# Altium schematic sheet PIC32ETH_Power.SchDoc: Power
size A4; SheetNumber: 6
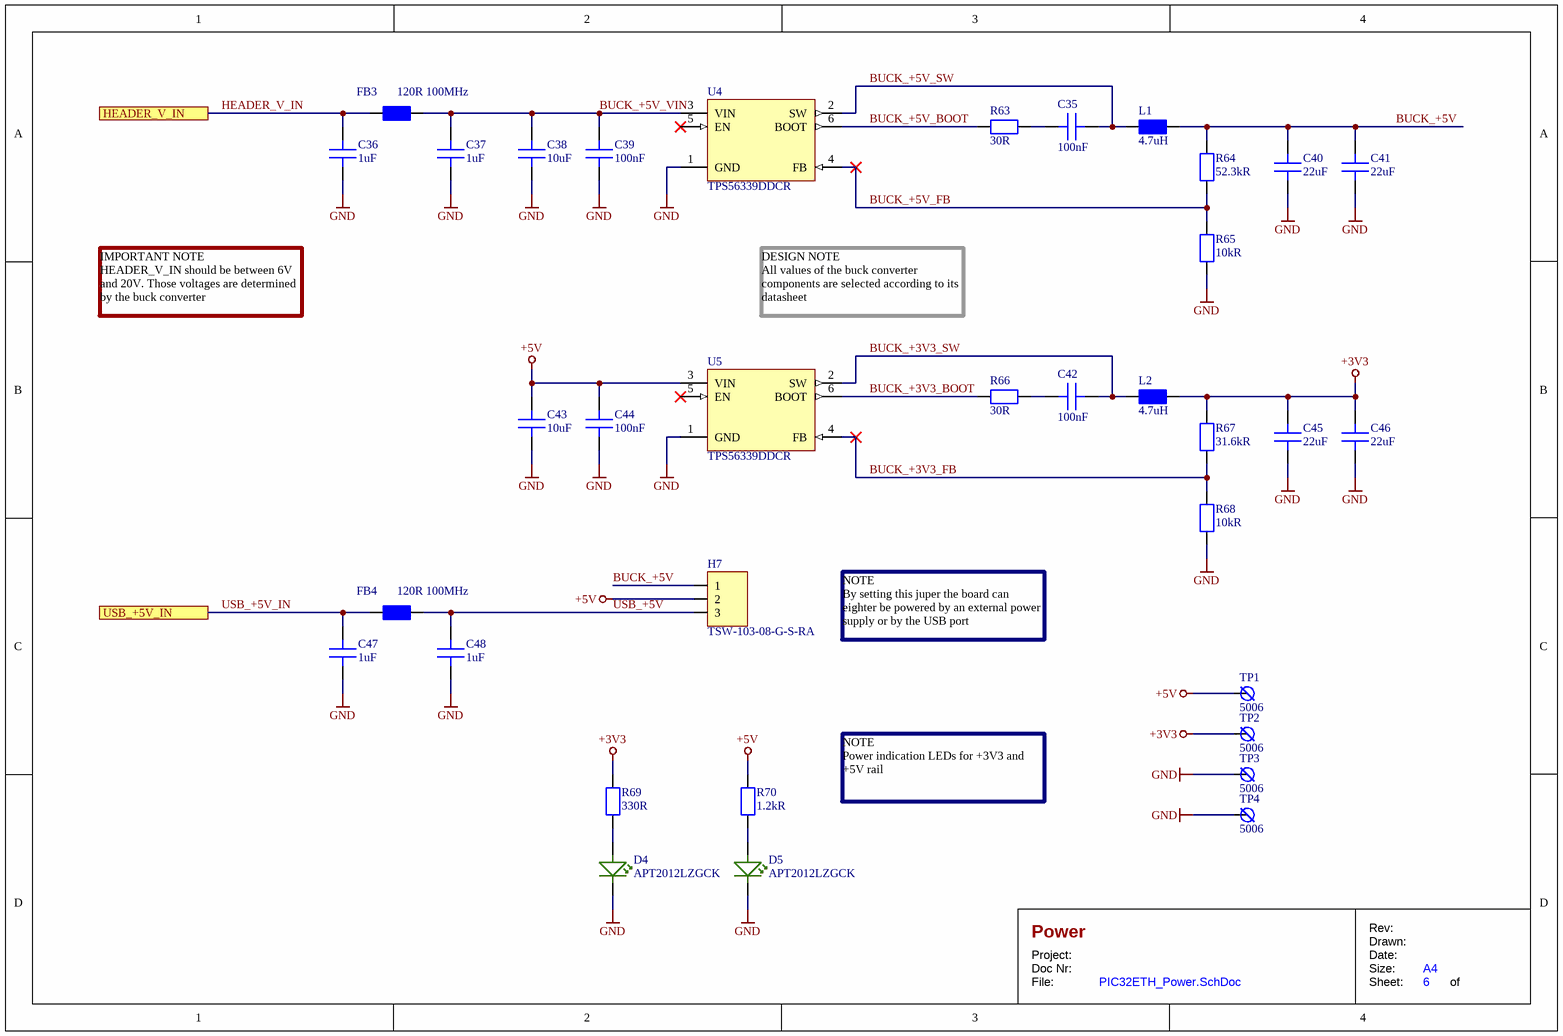
[diagram p0: PIC32ETH_Power.SchDoc]

## Parts
C35  100nF  [C_CHIP2012N]
C36  1uF  [C_CHIP2012N]
C37  1uF  [C_CHIP2012N]
C38  10uF  [C_CHIP3216N]
C39  100nF  [C_CHIP2012N]
C40  22uF  [C_CHIP3216N]
C41  22uF  [C_CHIP3216N]
C42  100nF  [C_CHIP2012N]
C43  10uF  [C_CHIP3216N]
C44  100nF  [C_CHIP2012N]
C45  22uF  [C_CHIP3216N]
C46  22uF  [C_CHIP3216N]
C47  1uF  [C_CHIP2012N]
C48  1uF  [C_CHIP2012N]
D4  APT2012LZGCK  [D_LEDCHIP2012N]
D5  APT2012LZGCK  [D_LEDCHIP2012N]
FB3  120R 100MHz  [FB_CHIP3216N]
FB4  120R 100MHz  [FB_CHIP3216N]
H7  TSW-103-08-G-S-RA  [H_TSW-103-08-G-S-RA]
L1  4.7uH  [L_CHIP2520N]
L2  4.7uH  [L_CHIP2520N]
R63  30R  [R_CHIP2012N]
R64  52.3kR  [R_CHIP2012N]
R65  10kR  [R_CHIP2012N]
R66  30R  [R_CHIP2012N]
R67  31.6kR  [R_CHIP2012N]
R68  10kR  [R_CHIP2012N]
R69  330R  [R_CHIP2012N]
R70  1.2kR  [R_CHIP2012N]
TP1  5006  [TP_5006]
TP2  5006  [TP_5006]
TP3  5006  [TP_5006]
TP4  5006  [TP_5006]
U4  TPS56339DDCR  [U_SOT95P280X145-6N]
U5  TPS56339DDCR  [U_SOT95P280X145-6N]

## Ports
HEADER_V_IN, USB_+5V_IN

## Nets
+3V3: C45.2 C46.2 L2.2 R67.2 R69.2 TP2.1(A)
+5V: C43.2 C44.2 H7.2 R70.2 TP1.1(A) U5.3(VIN)
GND: C36.1 C37.1 C38.1 C39.1 C40.1 C41.1 C43.1 C44.1 C45.1 C46.1 C47.1 C48.1 D4.1 D5.1 R65.1 R68.1 TP3.1(A) TP4.1(A) U4.1(GND) U5.1(GND)
BUCK_+3V3_BOOT: R66.1 U5.6(BOOT)
BUCK_+3V3_FB: R67.1 R68.2 U5.4(FB)
BUCK_+3V3_SW: C42.1 L2.1 U5.2(SW)
BUCK_+5V: C40.2 C41.2 H7.1 L1.2 R64.2
BUCK_+5V_BOOT: R63.1 U4.6(BOOT)
BUCK_+5V_FB: R64.1 R65.2 U4.4(FB)
BUCK_+5V_SW: C35.1 L1.1 U4.2(SW)
BUCK_+5V_VIN: C37.2 C38.2 C39.2 FB3.2 U4.3(VIN)
HEADER_V_IN: C36.2 FB3.1 ; port HEADER_V_IN
USB_+5V: C48.2 FB4.2 H7.3
USB_+5V_IN: C47.2 FB4.1 ; port USB_+5V_IN
NetC35_2: C35.2 R63.2
NetC42_2: C42.2 R66.2
NetD4_2: D4.2 R69.1
NetD5_2: D5.2 R70.1

Not connected (* = marked no-connect by the designer): U4 5(EN)*; U5 5(EN)*

## Notes on the sheet
- IMPORTANT NOTE
  HEADER_V_IN should be between 6V and 20V. Those voltages are determined by the buck converter
- DESIGN NOTE
  All values of the buck converter components are selected according to its datasheet
- NOTE
  By setting this juper the board can eighter be powered by an external power supply or by the USB port
- NOTE
  Power indication LEDs for +3V3 and +5V rail
- Project:
- Doc Nr:
- File:
- Drawn:
- Rev:
- Date:
- Size:
- Sheet:
- A4
- of

## Library data of the parts
C35 C39 C42 C44 = C_C0805C104K5RACTU: C CERAMIC 100nF 50V 10% 2012; Manufacturer: Kemet; Dielectric: X7R; Tolerance: +/-10%; Datasheet Url: https://content.kemet.com/datasheets/KEM_C1002_X7R_SMD.pdf; Mounting: SMT; Package: 2012; Part Number: C0805C104K5RACTU; Price: 0.23; Price Currency: CHF; Supplier 1: Digi-Key; Capacitance: 100nF; Voltage: 50V; Supplier Part Number 1: 399-1170-1-ND; Esr: n/a; Pin Count: 2; Temperature Range: -55degC to 125degC
C36 C37 C47 C48 = C_C0805C105K5RACTU: C CERAMIC 1uF 50V 10% 2012; Manufacturer: Kemet; Dielectric: X7R; Tolerance: +/-10%; Datasheet Url: https://content.kemet.com/datasheets/KEM_C1002_X7R_SMD.pdf; Mounting: SMT; Package: 2012; Part Number: C0805C105K5RACTU; Price: 0.32; Price Currency: CHF; Supplier 1: Digi-Key; Capacitance: 1uF; Voltage: 50V; Supplier Part Number 1: 399-7409-1-ND; Esr: n/a; Pin Count: 2; Temperature Range: -55degC to 125degC
C38 C43 = C_C1206C106K3RACTU: C CERAMIC 10uF 25V 10% 3216; Manufacturer: Kemet; Dielectric: X7R; Tolerance: +/-10%; Package: 3216; Supplier 1: Digi-Key; Part Number: C1206C106K3RACTU; Temperature Range: -55degC to 125degC; Datasheet Url: https://content.kemet.com/datasheets/KEM_C1002_X7R_SMD.pdf; Mounting: SMT; Price: 0.62; Price Currency: CHF; Note: *; Capacitance: 10uF; Voltage: 25V; Pin Count: 2; Esr: n/a; Supplier Part Number 1: 399-7442-1-ND
C40 C41 C45 C46 = C_C1206C226K8RAC7800: C CERAMIC 22uF 10V 10% 3216; Manufacturer: Kemet; Dielectric: X7R; Tolerance: +/-10%; Package: 3216; Supplier 1: Digi-Key; Part Number: C1206C226K8RAC7800; Temperature Range: -55degC to 125degC; Datasheet Url: https://api.kemet.com/component-edge/download/datasheet/C1206C226K8RAC7800.pdf; Mounting: SMT; Price: 0.65; Price Currency: CHF; Note: *; Capacitance: 22uF; Voltage: 10V; Pin Count: 2; Esr: n/a; Supplier Part Number 1: 399-11947-1-ND
D4 D5 = D_APT2012LZGCK: D LED GREEN CLEAR 2.65V 2mA 2012; Manufacturer: Kingbright; Voltage Reverse: 5V; Current Reverse: 50uA; Power: 102.5mW; Datasheet URL: http://www.kingbrightusa.com/images/catalog/SPEC/APT2012LZGCK.pdf; Mounting: SMT; Package: 2012; Part Number: APT2012LZGCK; Price: 0.55; Price Currency: CHF; Supplier 1: Digi-Key; Supplier Part Number 1: 754-1939-1-ND; Temperature Range: -40degC to 85degC; Pin Count: 2; Current Forward: 2mA; Voltage Forward: 2.65V; Color: Green; Lens Transparency: Clear
FB3 FB4 = FB_BLM31KN121SN1L: FB 120R 100MHz 6A 3216; Manufacturer: Murata Electronics; Resistance: 9mR; Datasheet Url: https://www.murata.com/en-us/products/productdata/8801529331742/ENFA0091.pdf; Mounting: SMT; Package: 3216; Part Number: BLM31KN121SN1L; Price: 0.29; Price Currency: CHF; Supplier 1: Digi-Key; Supplier Part Number 1: 490-16524-1-ND; Temperature Range: -55degC to 125degC; Pin Count: 2; Current: 6A; Impedance: 120R 100MHz
H7 = H_TSW-103-08-G-S-RA: H GENERAL HEADER 3POS 1ROW 2.54mm ANGLE THT; Manufacturer: Samtec Inc.; Current: 5.7A; Voltage: 550VAC, 770VDC; Positions: 3; Rows: 1; Datasheet URL: http://suddendocs.samtec.com/catalog_english/tsw_th.pdf; Mounting: THT; Package: n/a; Part Number: TSW-103-08-G-S-RA; Price: 0.40; Price Currency: CHF; Supplier 1: Digi-Key; Supplier Part Number 1: SAM1039-03-ND; Temperature Range: -55degC to 125degC; Pin Count: 3; Mating Cycles: n/a; Header Type: Header; Orientation: Angle; Spacing: 2.54mm
L1 L2 = L_LQM2HPN4R7MG0L: L CERAMIC 4.7uH 1.1A 138mR 2520; Manufacturer: Murata Electronics; Tolerance: +/-20%; Datasheet Url: https://search.murata.co.jp/Ceramy/image/img/P02/JELF243B-0019.pdf; Mounting: SMT; Package: 2520; Part Number: LQM2HPN4R7MG0L; Price: 0.28; Price Currency: CHF; Supplier 1: Digi-Key; Inductance: 4.7uH; Voltage: n/a; Supplier Part Number 1: 490-5116-1-ND; Pin Count: 2; Temperature Range: -55degC to 125degC; Current: 1.1A; Resistance: 138mR
R63 R66 = R_RMCF0805FT30R0: R SMT 30R 1% 125mW 2012; Manufacturer: Stackpole Electronics Inc; Temperature Coefficient: 100ppm/degC; Tolerance: +/-1%; Voltage: 150V; Datasheet Url: https://www.seielect.com/catalog/sei-rmcf_rmcp.pdf; Mounting: SMT; Package: 2012; Part Number: RMCF0805FT30R0; Price: 0.10; Price Currency: CHF; Supplier 1: Digi-Key; Resistance: 30R; Supplier Part Number 1: RMCF0805FT30R0CT-ND; Temperature Range: -55degC to 155degC; Pin Count: 2; Power: 125mW
R64 = R_RMCF0805FT52K3: R SMT 52.3kR 1% 125mW 2012; Manufacturer: Stackpole Electronics Inc; Temperature Coefficient: 100ppm/degC; Tolerance: +/-1%; Voltage: 150V; Datasheet Url: https://www.seielect.com/catalog/sei-rmcf_rmcp.pdf; Mounting: SMT; Package: 2012; Part Number: RMCF0805FT52K3; Price: 0.10; Price Currency: CHF; Supplier 1: Digi-Key; Resistance: 52.3kR; Supplier Part Number 1: RMCF0805FT52K3CT-ND; Temperature Range: -55degC to 155degC; Pin Count: 2; Power: 125mW
R65 R68 = R_RMCF0805FT10K0: R SMT 10kR 1% 125mW 2012; Manufacturer: Stackpole Electronics Inc; Temperature Coefficient: 100ppm/degC; Tolerance: +/-1%; Voltage: 150V; Datasheet Url: https://www.seielect.com/catalog/sei-rmcf_rmcp.pdf; Mounting: SMT; Package: 2012; Part Number: RMCF0805FT10K0; Price: 0.10; Price Currency: CHF; Supplier 1: Digi-Key; Resistance: 10kR; Power: 125mW; Supplier Part Number 1: RMCF0805FT10K0CT-ND; Pin Count: 2; Temperature Range: -55degC to 155degC
R67 = R_RMCF0805FT31K6: R SMT 31.6kR 1% 125mW 2012; Manufacturer: Stackpole Electronics Inc; Temperature Coefficient: 100ppm/degC; Tolerance: +/-1%; Voltage: 150V; Datasheet Url: https://www.seielect.com/catalog/sei-rmcf_rmcp.pdf; Mounting: SMT; Package: 2012; Part Number: RMCF0805FT31K6; Price: 0.10; Price Currency: CHF; Supplier 1: Digi-Key; Resistance: 31.6kR; Supplier Part Number 1: RMCF0805FT31K6CT-ND; Temperature Range: -55degC to 155degC; Pin Count: 2; Power: 125mW
R69 = R_RMCF0805FT330R: R SMT 330R 1% 125mW 2012; Manufacturer: Stackpole Electronics Inc; Temperature Coefficient: 100ppm/degC; Tolerance: +/-1%; Voltage: 150V; Datasheet Url: https://www.seielect.com/catalog/sei-rmcf_rmcp.pdf; Mounting: SMT; Package: 2012; Part Number: RMCF0805FT330R; Price: 0.10; Price Currency: CHF; Supplier 1: Digi-Key; Resistance: 330R; Supplier Part Number 1: RMCF0805FT330RCT-ND; Temperature Range: -55degC to 155degC; Pin Count: 2; Power: 125mW
R70 = R_RMCF0805FT1K20: R SMT 1.2kR 1% 125mW 2012; Manufacturer: Stackpole Electronics Inc; Temperature Coefficient: 100ppm/degC; Tolerance: +/-1%; Voltage: 150V; Datasheet Url: https://www.seielect.com/catalog/sei-rmcf_rmcp.pdf; Mounting: SMT; Package: 2012; Part Number: RMCF0805FT1K20; Price: 0.10; Price Currency: CHF; Supplier 1: Digi-Key; Resistance: 1.2kR; Supplier Part Number 1: RMCF0805FT1K20CT-ND; Temperature Range: -55degC to 155degC; Pin Count: 2; Power: 125mW
TP1-TP4 = TP_5006: TP COMPACT BLACK THT; Manufacturer: Keystone Electronics; Datasheet Url: https://www.keyelco.com/userAssets/file/M65p56.pdf; Mounting: THT; Package: n/a; Part Number: 5006; Price: 0.35; Price Currency: CHF; Supplier 1: Digi-Key; Current: n/a; Pin Count: 1; Temperature Range: n/a; Supplier Part Number 1: 36-5006-ND; Voltage: n/a; Color: Black
U4 U5 = U_TPS56339DDCR: U REGULATOR BUCK 0.8V TO 16V 3A SOT-23-6; Manufacturer: Texas Instruments; Voltage Input: 4.5V to 24V; Datasheet Url: https://www.ti.com/lit/ds/symlink/tps56339.pdf?ts=1604352153609&ref_url=https%253A%252F%252Fwww.ti.com%252Fproduct%252FTPS56339%253FkeyMatch%253DTPS56%2526tisearch%253DSearch-EN-everything%2526usecase%253DGPN; Mounting: SMT; Package: SOT-23-6; Part Number: TPS56339DDCR; Price: 1.14; Price Currency: CHF; Supplier 1: Digi-Key; Pin Count: 6; Supplier Part Number 1: 296-53568-1-ND; Temperature Range: -40degC to 125degC; Current Output: 3A; Regulator Type: Buck; Voltage Output: 0.8V to 16V